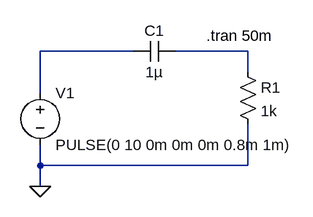
[diagram p0: schematic differentiator.asc]
differentiator.asc, the LTspice schematic file:
Version 4
SHEET 1 880 680
WIRE 176 16 32 16
WIRE 352 16 240 16
WIRE 352 48 352 16
WIRE 32 80 32 16
WIRE 32 192 32 160
WIRE 352 192 352 128
WIRE 352 192 32 192
WIRE 32 224 32 192
FLAG 32 224 0
SYMBOL voltage 32 64 R0
WINDOW 123 0 0 Left 2
WINDOW 39 0 0 Left 2
SYMATTR InstName V1
SYMATTR Value PULSE(0 10 0m 0m 0m 0.8m 1m)
SYMBOL cap 240 0 R90
WINDOW 0 0 32 VBottom 2
WINDOW 3 32 32 VTop 2
SYMATTR InstName C1
SYMATTR Value 1µ
SYMBOL res 336 32 R0
SYMATTR InstName R1
SYMATTR Value 1k
TEXT 288 -8 Left 2 !.tran 50m

The netlist it stands for:
* differentiator.asc
V1 N001 0 PULSE(0 10 0m 0m 0m 0.8m 1m)
C1 N002 N001 1µ
R1 N002 0 1k
.tran 50m
.backanno
.end